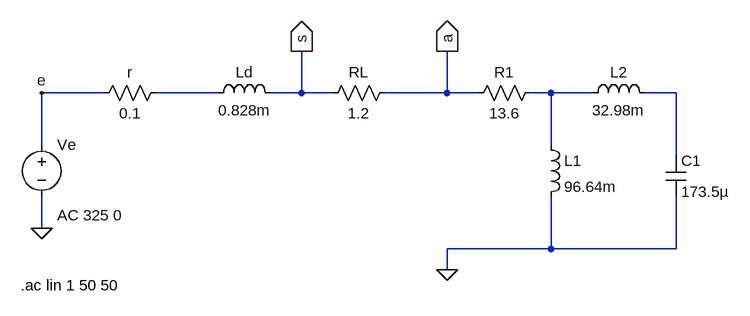
[diagram p0: schematic LAB3_CA_PB1.asc]
LAB3_CA_PB1.asc, the LTspice schematic file:
Version 4
SHEET 1 1148 680
WIRE 176 96 80 96
WIRE 352 96 256 96
WIRE 480 96 480 32
WIRE 480 96 432 96
WIRE 528 96 480 96
WIRE 704 96 704 32
WIRE 704 96 608 96
WIRE 752 96 704 96
WIRE 864 96 832 96
WIRE 928 96 864 96
WIRE 1056 96 1008 96
WIRE 80 176 80 96
WIRE 864 176 864 96
WIRE 1056 192 1056 96
WIRE 80 304 80 256
WIRE 864 336 864 256
WIRE 864 336 704 336
WIRE 1056 336 1056 256
WIRE 1056 336 864 336
WIRE 704 368 704 336
FLAG 80 304 0
FLAG 480 32 s
IOPIN 480 32 Out
FLAG 704 32 a
IOPIN 704 32 Out
FLAG 704 368 0
FLAG 80 96 e
SYMBOL voltage 80 160 R0
WINDOW 123 24 124 Left 2
WINDOW 39 0 0 Left 0
SYMATTR Value2 AC 325 0
SYMATTR InstName Ve
SYMATTR Value ""
SYMBOL res 272 80 R90
WINDOW 0 0 56 VBottom 2
WINDOW 3 32 56 VTop 2
SYMATTR InstName r
SYMATTR Value 0.1
SYMBOL ind 336 112 R270
WINDOW 0 32 56 VTop 2
WINDOW 3 5 56 VBottom 2
SYMATTR InstName Ld
SYMATTR Value 0.828m
SYMBOL res 848 80 R90
WINDOW 0 0 56 VBottom 2
WINDOW 3 32 56 VTop 2
SYMATTR InstName R1
SYMATTR Value 13.6
SYMBOL ind 848 160 R0
SYMATTR InstName L1
SYMATTR Value 96.64m
SYMBOL cap 1040 192 R0
SYMATTR InstName C1
SYMATTR Value 173.5µ
SYMBOL ind 912 112 R270
WINDOW 0 32 56 VTop 2
WINDOW 3 5 56 VBottom 2
SYMATTR InstName L2
SYMATTR Value 32.98m
SYMBOL res 512 112 R270
WINDOW 0 32 56 VTop 2
WINDOW 3 0 56 VBottom 2
SYMATTR InstName RL
SYMATTR Value 1.2
TEXT 48 392 Left 2 !.ac lin 1 50 50

The netlist it stands for:
* LAB3_CA_PB1.asc
Ve e 0 AC 325 0
r N001 e 0.1
Ld N001 s 0.828m
R1 N002 a 13.6
L1 N002 0 96.64m
C1 N003 0 173.5µ
L2 N002 N003 32.98m
RL s a 1.2
.ac lin 1 50 50
.backanno
.end